# Altium schematic sheet EFR32_Port_Pins.SchDoc: ERF32 PORT PINS
size A4; Date: 10/15/2019; Author: SORABH GANDHI; Organization: UNIVERSITY OF COLORADO BOULDER; SheetNumber: 6; SheetTotal: 10
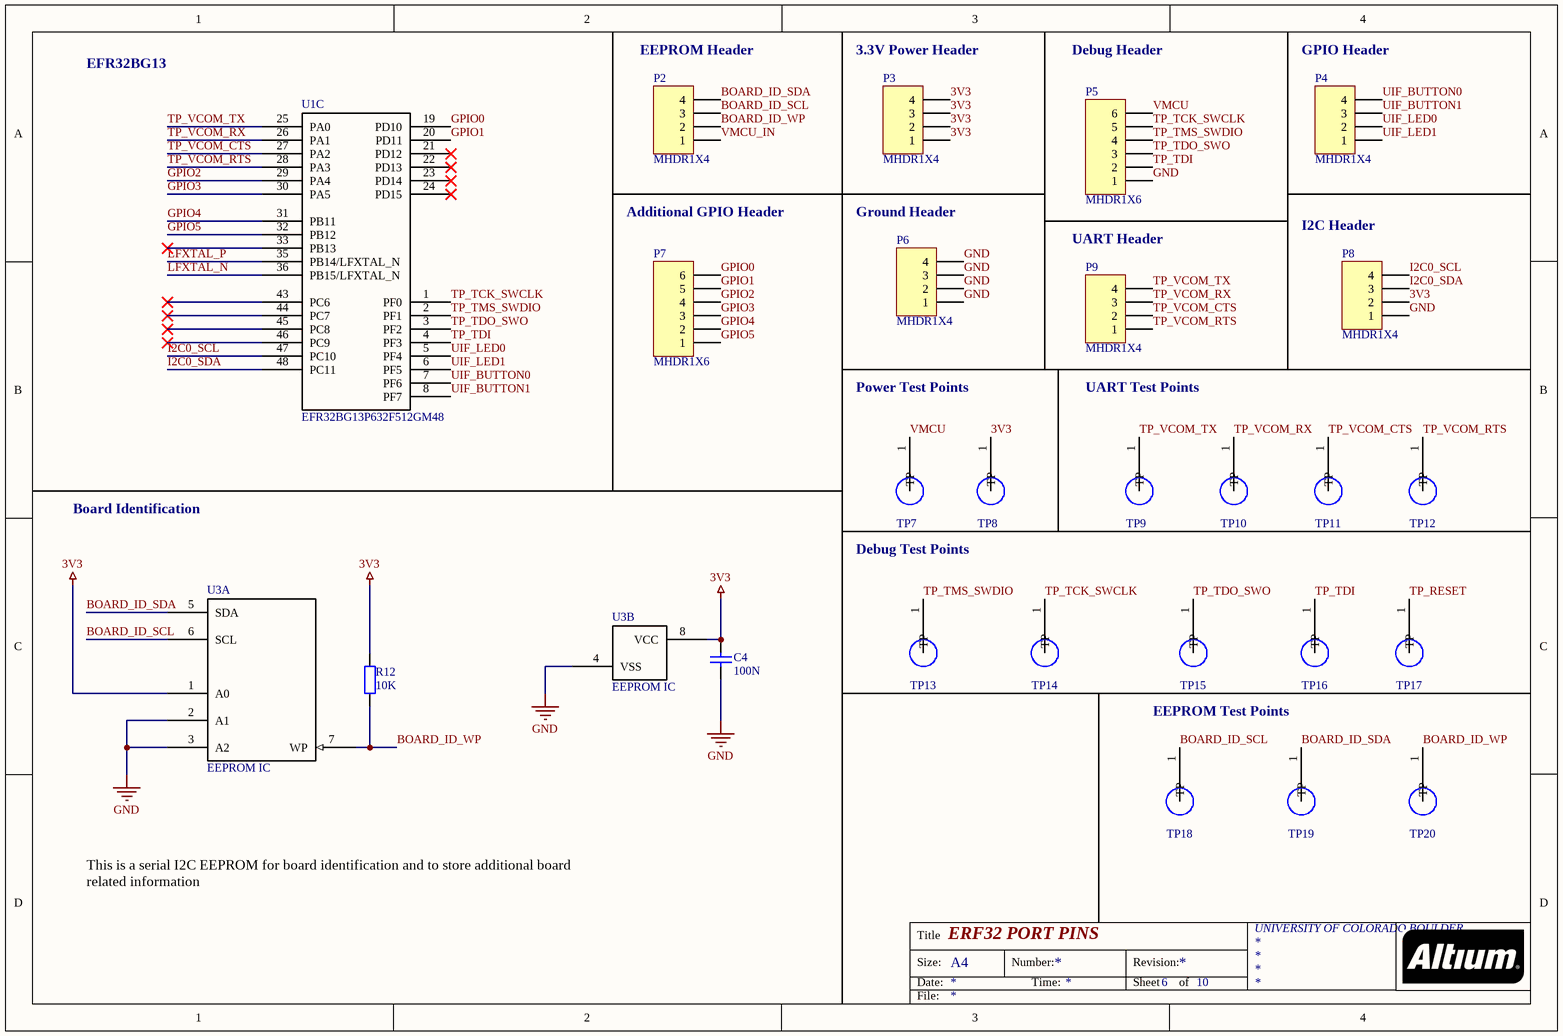
[diagram p0: EFR32_Port_Pins.SchDoc]

## Parts
C4  100N  [1608[0603]]
P2  MHDR1X4  [MHDR1X4]
P3  MHDR1X4  [MHDR1X4]
P4  MHDR1X4  [MHDR1X4]
P5  MHDR1X6  [MHDR1X6]
P6  MHDR1X4  [MHDR1X4]
P7  MHDR1X6  [MHDR1X6]
P8  MHDR1X4  [MHDR1X4]
P9  MHDR1X4  [MHDR1X4]
R12  10K  [AXIAL-0.4]
TP7  TP  [*TP380X203]  (value not drawn)
TP8  TP  [*TP380X203]  (value not drawn)
TP9  TP  [*TP380X203]  (value not drawn)
TP10  TP  [*TP380X203]  (value not drawn)
TP11  TP  [*TP380X203]  (value not drawn)
TP12  TP  [*TP380X203]  (value not drawn)
TP13  TP  [*TP380X203]  (value not drawn)
TP14  TP  [*TP380X203]  (value not drawn)
TP15  TP  [*TP380X203]  (value not drawn)
TP16  TP  [*TP380X203]  (value not drawn)
TP17  TP  [*TP380X203]  (value not drawn)
TP18  TP  [*TP380X203]  (value not drawn)
TP19  TP  [*TP380X203]  (value not drawn)
TP20  TP  [*TP380X203]  (value not drawn)
U1  EFR32BG13P632F512GM48  [*QFN50P700X700X90-49N]  (part C of 3)
U3  EEPROM IC  [*SON50P200X300X80-8N]  (parts A,B of 2)

## Nets
3V3: C4.2 P3.1 P3.2 P3.3 P3.4 P8.2 R12.2 TP8.1(TP) U3.1(A0) U3.8(VCC)
GND: C4.1 P5.1 P6.1 P6.2 P6.3 P6.4 P8.1 U3.2(A1) U3.3(A2) U3.4(VSS)
BOARD_ID_SCL: P2.3 TP18.1(TP) U3.6(SCL)
BOARD_ID_SDA: P2.4 TP19.1(TP) U3.5(SDA)
BOARD_ID_WP: P2.2 R12.1 TP20.1(TP) U3.7(WP)
GPIO0: P7.6 U1.19(PD10)
GPIO1: P7.5 U1.20(PD11)
GPIO2: P7.4 U1.29(PA4)
GPIO3: P7.3 U1.30(PA5)
GPIO4: P7.2 U1.31(PB11)
GPIO5: P7.1 U1.32(PB12)
I2C0_SCL: P8.4 U1.47(PC10)
I2C0_SDA: P8.3 U1.48(PC11)
LFXTAL_N: U1.36(PB15/LFXTAL_N)
LFXTAL_P: U1.35(PB14/LFXTAL_N)
TP_RESET: TP17.1(TP)
TP_TCK_SWCLK: P5.5 TP14.1(TP) U1.1(PF0)
TP_TDI: P5.2 TP16.1(TP) U1.4(PF3)
TP_TDO_SWO: P5.3 TP15.1(TP) U1.3(PF2)
TP_TMS_SWDIO: P5.4 TP13.1(TP) U1.2(PF1)
TP_VCOM_CTS: P9.2 TP11.1(TP) U1.27(PA2)
TP_VCOM_RTS: P9.1 TP12.1(TP) U1.28(PA3)
TP_VCOM_RX: P9.3 TP10.1(TP) U1.26(PA1)
TP_VCOM_TX: P9.4 TP9.1(TP) U1.25(PA0)
UIF_BUTTON0: P4.4 U1.7(PF6)
UIF_BUTTON1: P4.3 U1.8(PF7)
UIF_LED0: P4.2 U1.5(PF4)
UIF_LED1: P4.1 U1.6(PF5)
VMCU: P5.6 TP7.1(TP)
VMCU_IN: P2.1

Not connected (* = marked no-connect by the designer): U1 21(PD12)* 22(PD13)* 23(PD14)* 24(PD15)* 33(PB13)* 43(PC6)* 44(PC7)* 45(PC8)* 46(PC9)*

## Notes on the sheet
- EFR32BG13
- (near P2) EEPROM Header
- (near P3) 3.3V Power Header
- Debug Header
- (near P4) GPIO Header
- Additional GPIO Header
- Ground Header
- UART Header
- (near P8) I2C Header
- Power Test Points
- UART Test Points
- Board Identification
- Debug Test Points
- EEPROM Test Points
- This is a serial I2C EEPROM for board identification and to store additional board related information
- Title
- Size:
- Date:
- A4
- Number:
- Time:
- Revision:
- Sheet
- of
- File:

## Library data of the parts
C4 = Cap: CAP CER 0.1UF 16V X7R 0603; Manufacturer: Samsung Electro-Mechanics; Manufacturer Part Number: CL10B104KO8NNNC; Value: 100N; Digi-Key Part Number: 1276-1005-1-ND; DigiKeyURL: https://www.digikey.com/product-detail/en/samsung-electro-mechanics/CL10B104KO8NNNC/1276-1005-1-ND/3889091
P2-P4 P6 P8 P9 = MHDR1X4: CONN HEADER VERT 4POS 2.54MM; Manufacturer: Würth Elektronik; Manufacturer Part Number: 61300411121; Digi-Key Part Number: 732-5317-ND; DigikeyURL: https://www.digikey.com/product-detail/en/w-rth-elektronik/61300411121/732-5317-ND/4846827
P5 P7 = MHDR1X6: CONN HEADER VERT 6POS 2.54MM; Manufacturer: Amphenol ICC (FCI); Manufacturer Part Number: 68000-406HLF; Digi-Key Part Number: 609-3263-ND; DigikeyURL: https://www.digikey.com/product-detail/en/amphenol-icc-fci/68000-406HLF/609-3263-ND/1878471
R12 = Res2: RES 10K OHM 1% 1/8W 0603; Manufacturer: Stackpole Electronics Inc; Manufacturer Part Number: RNCP0603FTD10K0; Value: 10K; Digi-Key Part Number: RNCP0603FTD10K0CT-ND; DigiKeyURL: https://www.digikey.com/product-detail/en/stackpole-electronics-inc/RNCP0603FTD10K0/RNCP0603FTD10K0CT-ND/2240478
TP7-TP20 = TP: PC TEST POINT MINIATURE; Manufacturer: Keystone Electronics; Manufacturer Part Number: 5019; Snapeda_Url: https://www.snapeda.com/parts/5019/Keystone%20Electronics/view-part/?ref=search&t=5019; DigiKeyURL: https://www.digikey.com/product-detail/en/keystone-electronics/5019/36-5019CT-ND/3907344?utm_source=snapeda&utm_medium=aggregator&utm_campaign=symbol; Digi-Key Part Number: 36-5019CT-ND
U1 = EFR32BG13: MCU; Manufacturer: Silicon Labs; Manufacturer Part Number: EFR32BG13P632F512GM48-BR; CompDescription: Data Sheet; Value: EFR32BG13P632F512GM48; CompURL: https://www.silabs.com/documents/public/data-sheets/efr32bg13-datasheet.pdf; Mouser Part Number: 634-EFR32BG13P632-BR; MouserURL: https://www.mouser.com/ProductDetail/Silicon-Labs/EFR32BG13P632F512GM48-BR?qs=5aG0NVq1C4xCQ7DNn6l3Yw%3D%3D
U3 = EEPROM IC: EEPROM 2K 256X8 SER EE 1.8V 18 I/O 10-BIT ADC; Manufacturer Part Number: 24AA024T-I/MNY; Manufacturer: Microchip Technology; Mouser Part Number: 579-24AA024T-I/MNY; MouserURL: https://www.mouser.com/ProductDetail/Microchip-Technology/24AA024T-I-MNY?qs=Gia6%252BsTQdYODIfKOLLxKRw%3D%3D